# EAGLE design PlusCartUnified3 (EAGLE 9.5.2)
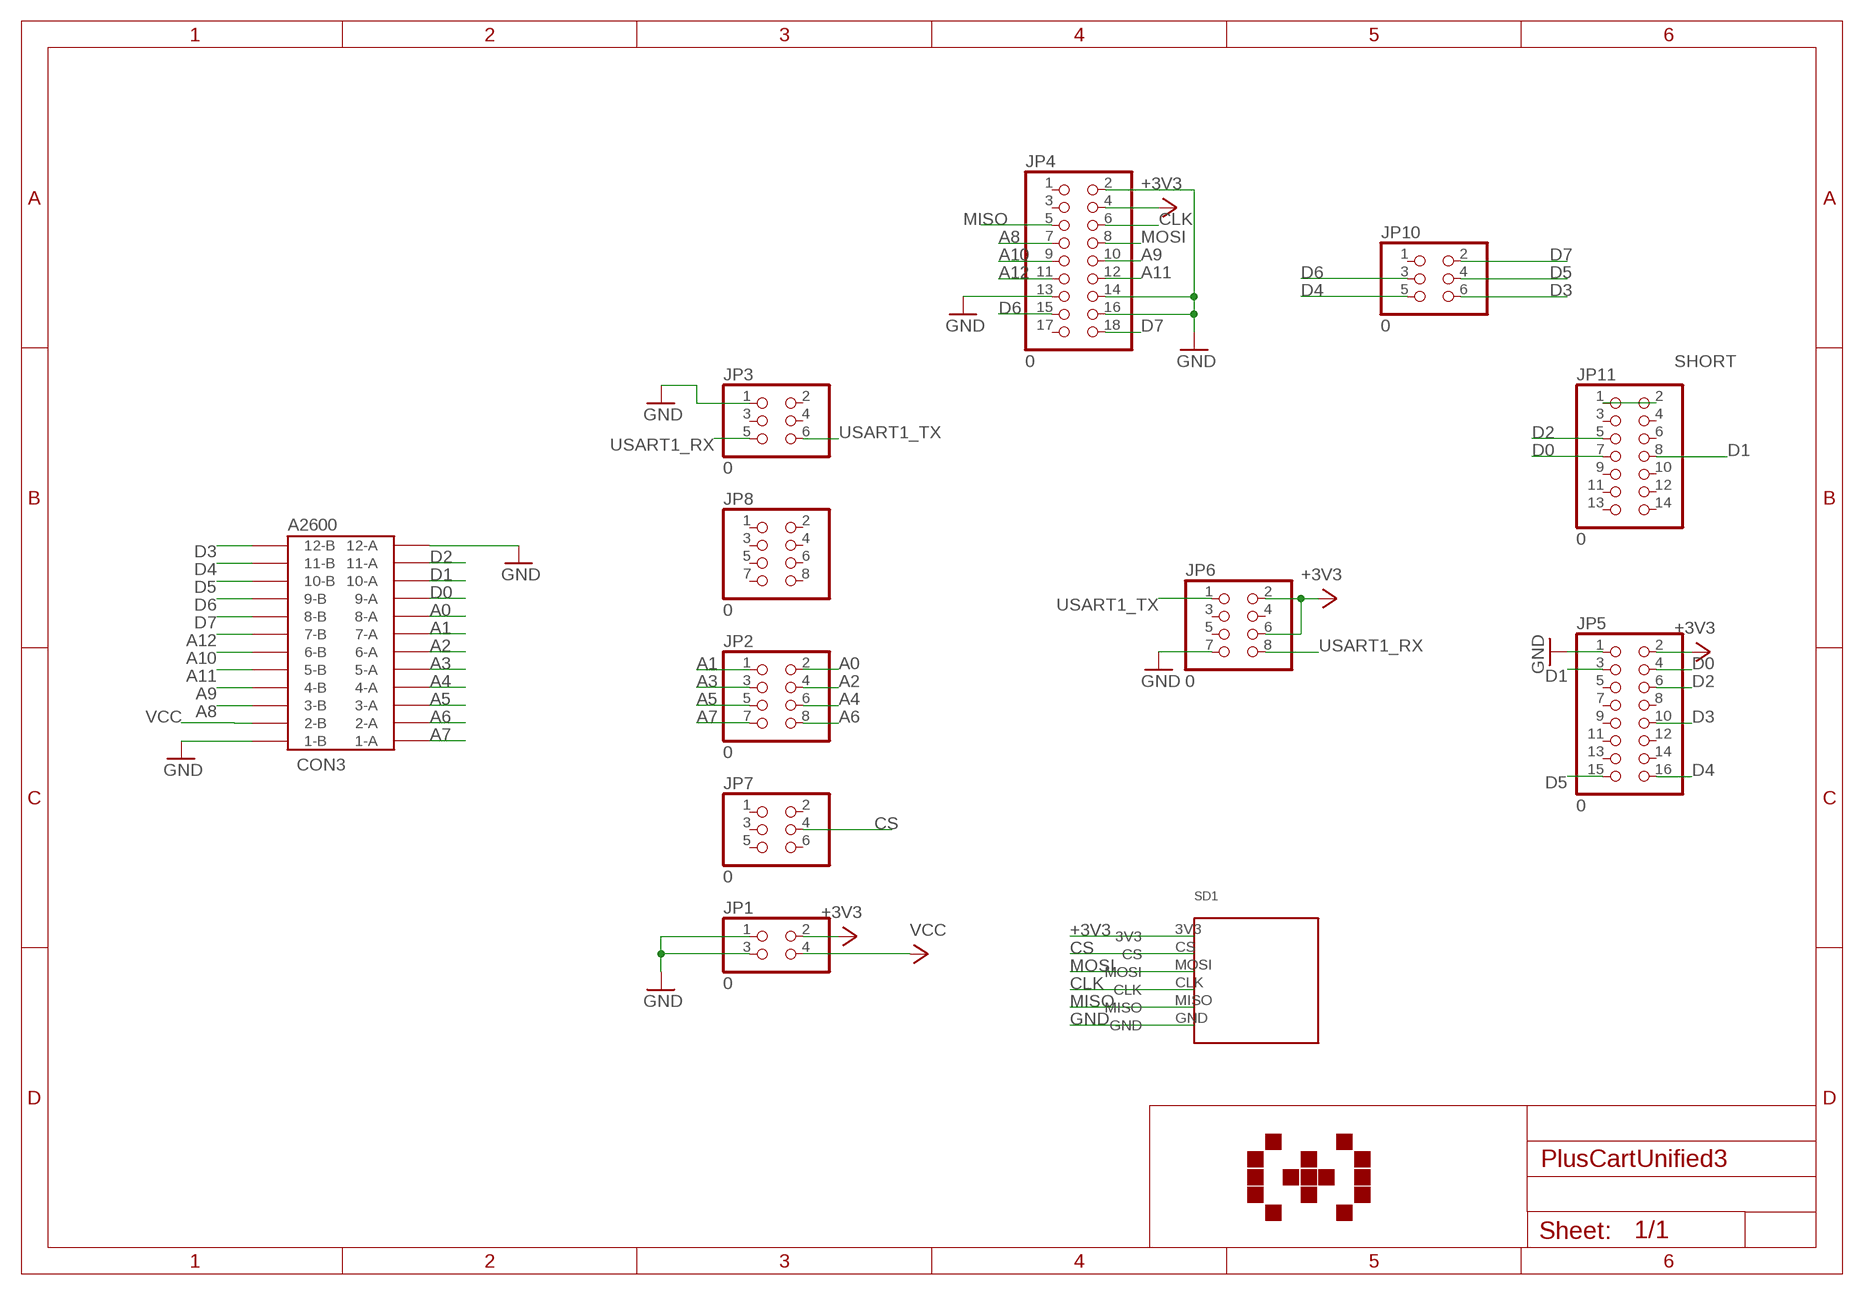
[diagram p0: schematic, sheet 1]

## Parts
CON3  A2600  24PINEDGE-254MM  [24PINEDGE-254MM]
JP1  0  PINHD-2X2  [2X02]
JP2  0  PINHD-2X4  [2X04]
JP3  0  PINHD-2X3  [2X03]
JP4  0  PINHD-2X9  [2X09]
JP5  0  PINHD-2X8  [2X08]
JP6  0  PINHD-2X4  [2X04]
JP7  0  PINHD-2X3  [2X03]
JP8  0  PINHD-2X4  [2X04]
JP10  0  PINHD-2X3  [2X03]
JP11  0  PINHD-2X7  [2X07]
SD1  MICROSDMICROSD2  [MICROSD_FOOTPRINT]

## Nets
+3V3: JP1.2 JP4.4 JP5.2 JP6.2 JP6.6 SD1.3V3
A0: CON3.8-A JP2.2
A1: CON3.7-A JP2.1
A2: CON3.6-A JP2.4
A3: CON3.5-A JP2.3
A4: CON3.4-A JP2.6
A5: CON3.3-A JP2.5
A6: CON3.2-A JP2.8
A7: CON3.1-A JP2.7
A8: CON3.3-B JP4.7
A9: CON3.4-B JP4.10
A10: CON3.6-B JP4.9
A11: CON3.5-B JP4.12
A12: CON3.7-B JP4.11
CLK: JP4.6 SD1.CLK
CS: JP7.4 SD1.CS
D0: CON3.9-A JP5.4 JP11.7
D1: CON3.10-A JP5.3 JP11.8
D2: CON3.11-A JP5.6 JP11.5
D3: CON3.12-B JP5.10 JP10.6
D4: CON3.11-B JP5.16 JP10.5
D5: CON3.10-B JP5.15 JP10.4
D6: CON3.9-B JP4.15 JP10.3
D7: CON3.8-B JP4.18 JP10.2
GND: CON3.1-B CON3.12-A JP1.1 JP1.3 JP3.1 JP4.2 JP4.13 JP4.14 JP4.16 JP5.1 JP6.7 SD1.GND
MISO: JP4.5 SD1.MISO
MOSI: JP4.8 SD1.MOSI
SHORT: JP11.1 JP11.2
USART1_RX: JP3.5 JP6.8
USART1_TX: JP3.6 JP6.1
VCC: CON3.2-B JP1.4
Unconnected: JP3.2 JP3.3 JP3.4 JP4.1 JP4.3 JP4.17 JP5.5 JP5.7 JP5.8 JP5.9 JP5.11 JP5.12 JP5.13 JP5.14 JP6.3 JP6.4 JP6.5 JP7.1 JP7.2 JP7.3 JP7.5 JP7.6 JP8.1 JP8.2 JP8.3 JP8.4 JP8.5 JP8.6 JP8.7 JP8.8 JP10.1 JP11.3 JP11.4 JP11.6 JP11.9 JP11.10 JP11.11 JP11.12 JP11.13 JP11.14

## Library data of the parts
CON3 = con-edge:24PINEDGE-254MM: 24 PIN EDGE CONNECTOR 2.54mm ATARI 2600 CARTRIDGE PORT
JP1 = pinhead:PINHD-2X2: PIN HEADER
JP2 JP6 = pinhead:PINHD-2X4: PIN HEADER
JP3 = pinhead:PINHD-2X3: PIN HEADER
JP4 = pinhead:PINHD-2X9: PIN HEADER
JP5 = pinhead:PINHD-2X8: PIN HEADER
JP7 JP10 = pinhead@1:PINHD-2X3: PIN HEADER
JP8 = pinhead@1:PINHD-2X4: PIN HEADER
JP11 = pinhead@1:PINHD-2X7: PIN HEADER
SD1 = MICROSD:MICROSD

## Board
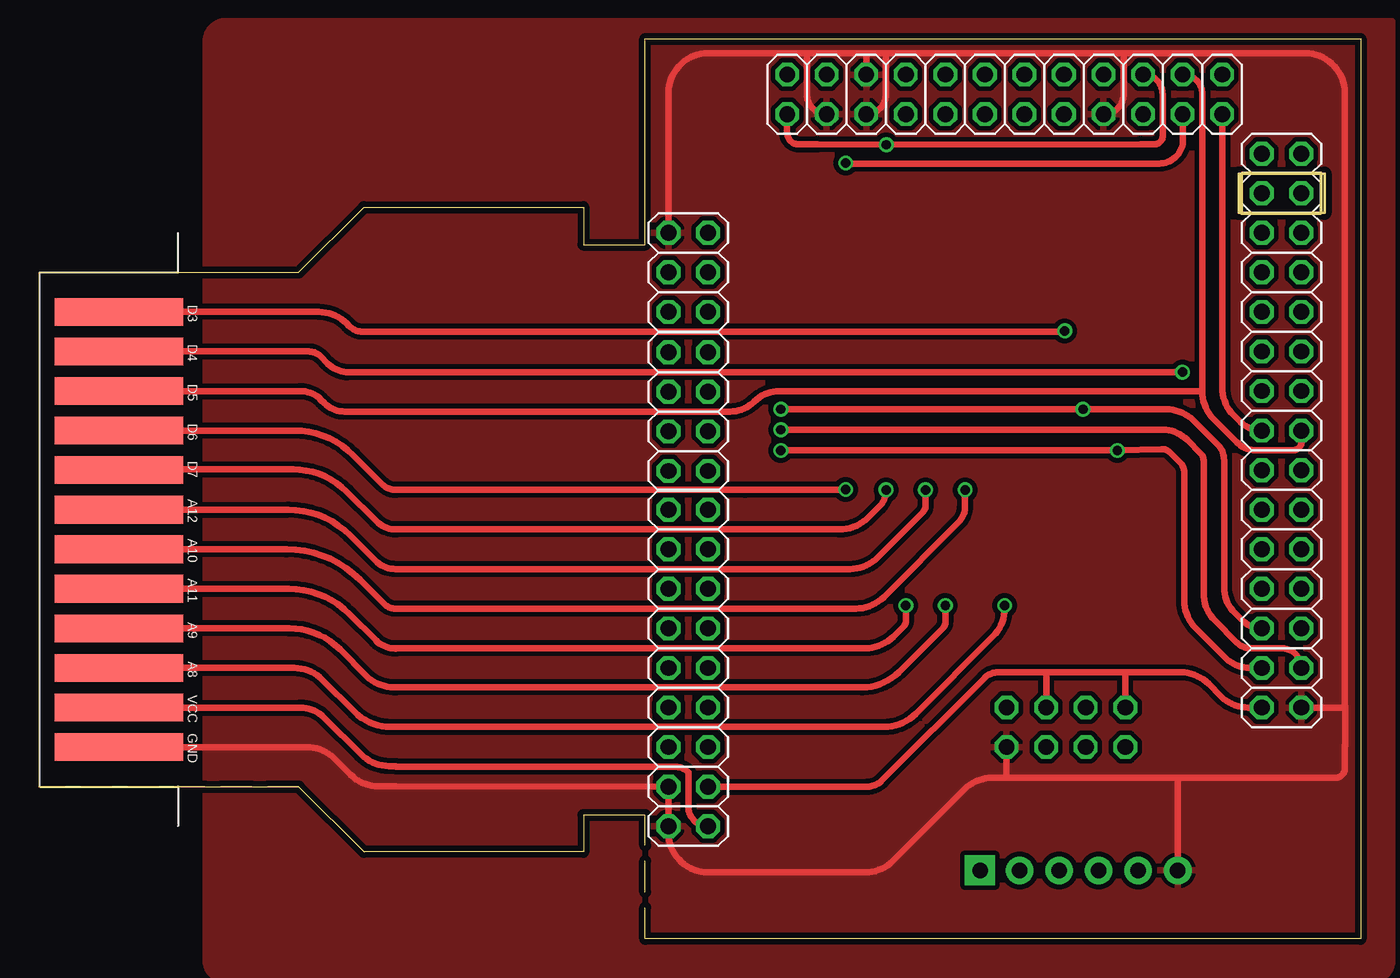
[diagram p1: board, top side]
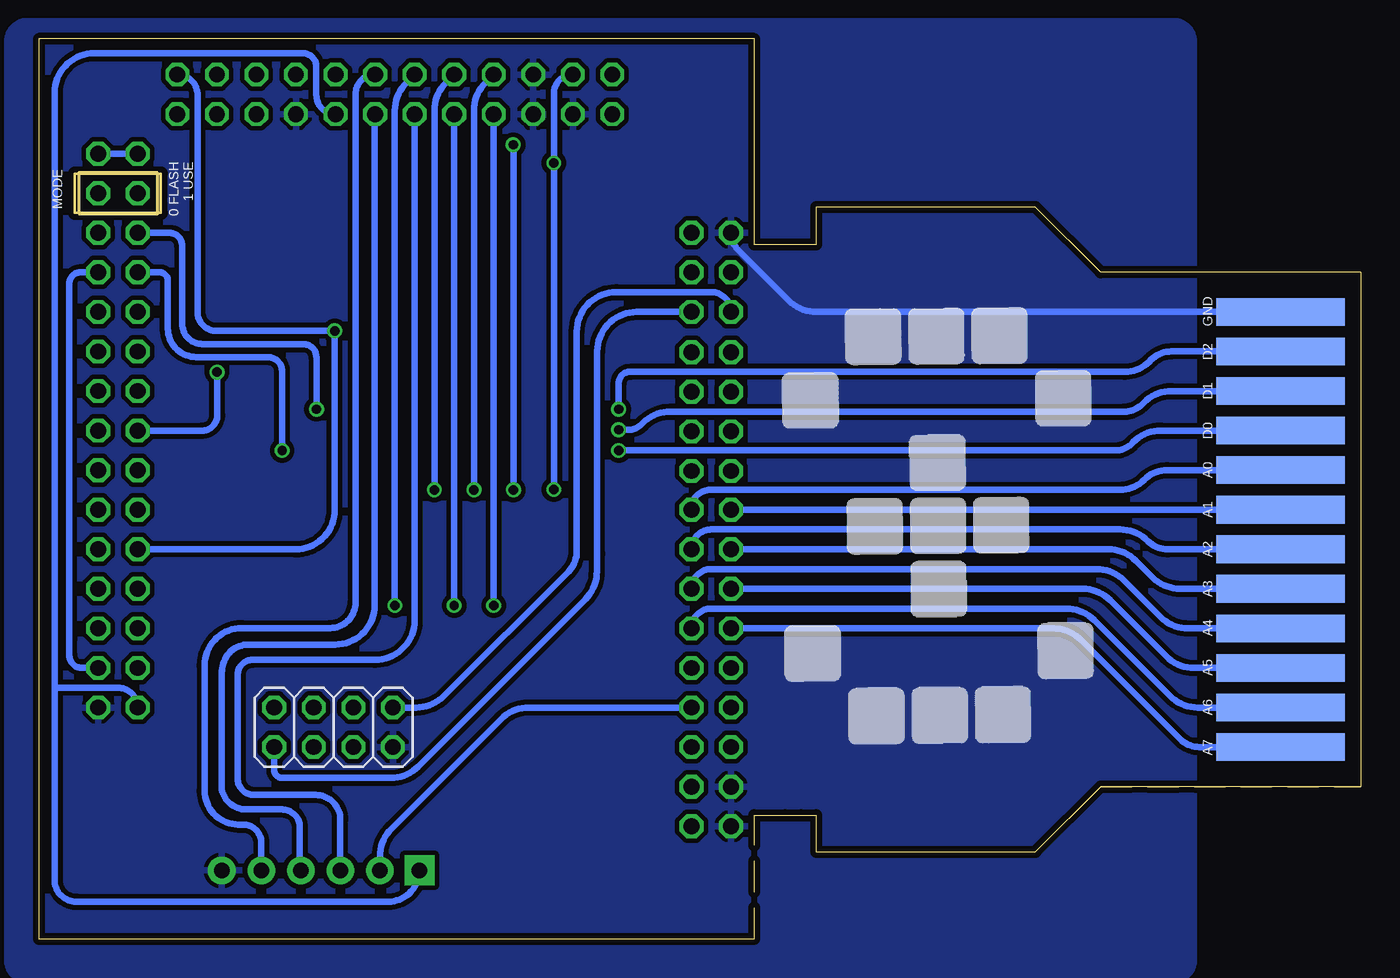
[diagram p2: board, bottom side, seen from below]

Size 84.89 x 57.78 mm. Coordinates in mm from the lower left corner, seen from the top.
Outline: 38.94,7.94 34.98,7.94
Outline: 34.98,7.94 34.98,5.58 20.88,5.58 16.69,9.77
Outline: 0,9.77 0,42.79 16.69,42.79 20.88,46.98 34.98,46.98 34.98,44.57 38.94,44.57 38.94,57.78 84.89,57.78 84.89,0 38.94,0 38.94,7.94
Outline: 0,9.77 16.69,9.77
Outline: 38.94,7.94 34.98,7.94
Outline: 16.69,9.77 0,9.77
Copper layers (1*16): Top 0.0356mm / dielectric 1.5011mm / Bottom 0.0356mm
Design rules "OSHPark2layer": minimum track width 6mil, minimum drill 13mil, track to track 6mil, track to pad 6mil, pad to pad 6mil, via to via 6mil, smd to smd 6mil, copper to edge 15mil, drill to drill 6mil, minimum pad ring 7mil, minimum via ring 7mil, stop-mask expansion 3mil, vias tented up to drill 0mil, thermal gap 10mil
Milling: 4 lines

### Footprints (pad centres in the part's own frame; a part is rotated, then mirrored left to right if it is on the bottom)
24PINEDGE-254MM = smd 1.778 x 8.255: 1-A -22.86,-7.62; 2-A -20.32,-7.62; 3-A -17.78,-7.62; 4-A -15.24,-7.62; 5-A -12.7,-7.62; 6-A -10.16,-7.62; 7-A -7.62,-7.62; 8-A -5.08,-7.62; 9-A -2.54,-7.62; 10-A 0,-7.62; 11-A 2.54,-7.62; 12-A 5.08,-7.62 | smd 1.778 x 8.255 bottom: 1-B -22.86,-7.62; 2-B -20.32,-7.62; 3-B -17.78,-7.62; 4-B -15.24,-7.62; 5-B -12.7,-7.62; 6-B -10.16,-7.62; 7-B -7.62,-7.62; 8-B -5.08,-7.62; 9-B -2.54,-7.62; 10-B 0,-7.62; 11-B 2.54,-7.62; 12-B 5.08,-7.62
2X02 = drill 1.016 octagon: 1 -1.27,-1.27; 2 -1.27,1.27; 3 1.27,-1.27; 4 1.27,1.27
2X04 = drill 1.016 octagon: 1 -3.81,-1.27; 2 -3.81,1.27; 3 -1.27,-1.27; 4 -1.27,1.27; 5 1.27,-1.27; 6 1.27,1.27; 7 3.81,-1.27; 8 3.81,1.27
2X03 = drill 1.016 octagon: 1 -2.54,-1.27; 2 -2.54,1.27; 3 0,-1.27; 4 0,1.27; 5 2.54,-1.27; 6 2.54,1.27
2X09 = drill 1.016 octagon: 1 -10.16,-1.27; 2 -10.16,1.27; 3 -7.62,-1.27; 4 -7.62,1.27; 5 -5.08,-1.27; 6 -5.08,1.27; 7 -2.54,-1.27; 8 -2.54,1.27; 9 0,-1.27; 10 0,1.27; 11 2.54,-1.27; 12 2.54,1.27; 13 5.08,-1.27; 14 5.08,1.27; 15 7.62,-1.27; 16 7.62,1.27; 17 10.16,-1.27; 18 10.16,1.27
2X08 = drill 1.016 octagon: 1 -8.89,-1.27; 2 -8.89,1.27; 3 -6.35,-1.27; 4 -6.35,1.27; 5 -3.81,-1.27; 6 -3.81,1.27; 7 -1.27,-1.27; 8 -1.27,1.27; 9 1.27,-1.27; 10 1.27,1.27; 11 3.81,-1.27; 12 3.81,1.27; 13 6.35,-1.27; 14 6.35,1.27; 15 8.89,-1.27; 16 8.89,1.27
2X07 = drill 1.016 octagon: 1 -7.62,-1.27; 2 -7.62,1.27; 3 -5.08,-1.27; 4 -5.08,1.27; 5 -2.54,-1.27; 6 -2.54,1.27; 7 0,-1.27; 8 0,1.27; 9 2.54,-1.27; 10 2.54,1.27; 11 5.08,-1.27; 12 5.08,1.27; 13 7.62,-1.27; 14 7.62,1.27
MICROSD_FOOTPRINT = drill 1 pad 1.93 square: 3V3 -15.24,6.35 | drill 1 pad 1.778: CLK -15.24,-1.27; CS -15.24,3.81; GND -15.24,-6.35; MISO -15.24,-3.81; MOSI -15.24,1.27

### Placement (x,y rotation side)
CON3  12.75,35.17 90 bottom
JP1  41.71,8.5 270 top
JP2  41.71,23.74 270 top
JP3  41.71,42.79 270 top
JP4  58.22,54.22 180 top
JP5  79.81,23.74 90 top
JP6  65.96,13.58 0 bottom
JP7  41.71,14.85 270 top
JP8  41.71,33.85 270 top
JP10  73.46,54.22 0 top
JP11  79.81,42.79 270 top
SD1  66.8,-10.85 270 bottom

### Tracks (layer width: path | path; a pad name or v marks a point on that pad's centre or on a via)
+3V3
  Top 0.406: JP1.2 53.22,9.77 arc45 54.12,10.14 60.71,16.74 arc-45 61.61,17.11 64.78,17.11 | JP5.2 77.67,14.85 arc-45 75.92,15.57 75.13,16.37 arc45 73.33,17.11 69.84,17.11 | 64.78,17.11 69.84,17.11 | JP6.6 64.69,16.89 arc-45 64.78,17.11 | JP6.2 69.77,16.94 arc-45 69.84,17.11
  Bottom 0.406: JP4.4 arc90 67.07,54.18 67.07,56 arc-90 67.94,56.86 81.33,56.86 arc-90 83.87,54.33 83.87,16.16 | JP5.2 arc-90 79.81,16.12 83.83,16.12 arc90 83.87,16.16 | 83.87,16.16 83.87,6.89 arc90 83.88,6.88 83.88,3.78 arc-90 82.49,2.39 62.45,2.39 arc-90 SD1.3V3
A0
  Bottom 0.406: JP2.2 42.98,27.62 arc90 41.77,28.83 15.47,28.83 arc-45 13.89,29.48 arc45 12.42,30.09 CON3.8-A
A1
  Bottom 0.406: JP2.1 CON3.7-A
A2
  Bottom 0.406: JP2.4 arc90 41.71,26.28 15.45,26.28 arc45 13.66,25.54 arc-45 12.39,25.01 CON3.6-A
A3
  Bottom 0.406: JP2.3 16.22,25.01 arc45 14.42,24.27 13.37,23.21 arc-45 11.57,22.47 CON3.5-A
A4
  Bottom 0.406: JP2.6 arc90 41.71,23.74 16.98,23.74 arc45 15.18,23 12.86,20.68 arc-45 11.06,19.93 CON3.4-A
A5
  Bottom 0.406: JP2.5 17.87,22.47 arc45 16.07,21.73 12.48,18.13 arc-45 10.68,17.39 CON3.3-A
A6
  Bottom 0.406: JP2.8 arc90 41.71,21.2 18.91,21.2 arc45 17.11,20.46 12.25,15.6 arc-45 10.45,14.85 CON3.2-A
A7
  Bottom 0.406: JP2.7 19.75,19.93 arc45 17.95,19.19 11.58,12.82 arc-45 10.36,12.31 CON3.1-A
A8  (via drill 0.6)
  Top 0.406: CON3.3-B 16.4,17.39 arc-45 18.19,16.65 20.26,14.58 arc45 22.6,13.61 54.28,13.61 arc45 56.32,14.45 61.28,19.42 arc45 62.03,21.21 v62.03,21.4
  Bottom 0.406: JP4.7 61.28,54.97 arc-45 62.03,53.17 v62.03,21.4
A9  (via drill 0.6)
  Top 0.406: v58.22,21.4 58.22,20.34 arc-45 58.05,19.95 55.23,17.12 arc-45 52.89,16.15 22.91,16.15 22.82,16.15 arc-45 21.02,16.89 19.33,18.58 arc45 16.08,19.93 CON3.4-B
  Bottom 0.406: JP4.10 v58.22,21.4
A10  (via drill 0.6)
  Top 0.406: v59.49,28.82 59.49,27.78 arc-45 59.06,26.74 54.26,21.95 arc-45 52.47,21.2 22.91,21.2 arc-45 22.17,21.51 20.62,23.06 arc45 15.91,25.01 CON3.6-B
  Bottom 0.406: JP4.9 58.74,54.97 arc-45 59.49,53.17 v59.49,28.82
A11  (via drill 0.6)
  Top 0.406: v55.68,21.4 55.68,20.39 arc-45 55.55,20.09 54.87,19.41 arc-45 53.07,18.66 22.97,18.66 arc45 22.91,18.64 arc-45 21.65,19.16 19.96,20.85 arc45 16.05,22.47 CON3.5-B
  Bottom 0.406: JP4.12 v55.68,21.4
A12  (via drill 0.6)
  Top 0.406: v56.95,28.82 56.95,27.83 arc-45 56.75,27.35 53.88,24.48 arc-45 52.08,23.74 22.91,23.74 arc-45 21.61,24.28 19.98,25.91 arc45 16.01,27.55 CON3.7-B
  Bottom 0.406: JP4.11 56.2,54.97 arc-45 56.95,53.17 v56.95,28.82
CLK
  Bottom 0.406: JP4.6 arc-45 63.32,52.9 63.32,21.43 arc90 65.86,18.89 71.42,18.89 arc-90 73.11,17.2 arc-90 73.16,17.15 73.16,9.89 arc-90 71.59,8.31 69.27,8.31 arc90 68.13,7.17 68.13,4.46 arc-90 SD1.CLK
CS
  Bottom 0.406: JP7.4 53.41,14.85 arc-45 55.21,14.11 62.24,7.07 arc-45 62.99,5.28 SD1.CS
D0  (via drill 0.6)
  Top 0.406: JP5.4 77.76,17.39 arc-45 76.23,18.03 74.3,19.95 arc-45 73.56,21.75 73.56,29.97 arc45 73.31,30.57 72.64,31.23 arc45 72.13,31.45 v69.27,31.35 v47.65,31.35
  Bottom 0.406: v47.65,31.35 15.77,31.35 arc-45 14.71,31.79 14.61,31.89 arc45 12.82,32.63 CON3.9-A | v69.27,31.35 69.27,36.43 arc-90 70.19,37.35 74.77,37.35 arc90 76.6,39.18 76.6,40.86 arc-90 76.6,40.86 76.6,42.26 arc-90 77.13,42.79 JP11.7
D1  (via drill 0.6)
  Top 0.406: JP5.3 81.08,17.4 arc90 79.83,18.65 77.87,18.65 arc-45 76.9,19.05 75.55,20.41 arc-45 74.8,22.2 74.8,30.73 arc45 74.62,31.16 73.75,32.03 arc45 72.19,32.68 v47.65,32.68
  Bottom 0.406: CON3.10-A 12.13,35.17 arc-45 13.93,34.43 14.02,34.33 arc45 15.19,33.85 44.31,33.85 arc-45 46.11,33.11 46.18,33.04 arc45 47.04,32.68 v47.65,32.68 | JP11.8 82.23,42.79 arc-90 82.93,42.09 82.93,40.91 arc-90 82.93,40.91 82.93,19.24 arc-90 82.93,19.24 82.93,18.21 arc-90 82.11,17.39 JP5.3
D2  (via drill 0.6)
  Top 0.406: v47.65,34 v67.06,34 72.38,34 arc-45 74.18,33.26 75.72,31.72 arc-45 76.12,30.73 76.12,22.58 arc45 76.81,20.92 77.28,20.45 arc45 JP5.6
  Bottom 0.406: v47.65,34 47.65,35.68 arc90 46.92,36.41 15.15,36.41 arc-45 13.57,37.06 13.46,37.17 arc45 12.16,37.71 CON3.11-A | v67.06,34 arc90 v67.07,34.01 67.07,37.33 arc-90 67.92,38.19 74.39,38.19 arc90 75.68,39.48 75.68,42.79 arc90 75.69,42.8 75.69,44.51 arc-90 76.51,45.33 JP11.5
D3  (via drill 0.6)
  Top 0.406: v65.89,39.03 65.83,38.98 20.81,38.98 arc-45 19.94,39.34 19.77,39.51 arc45 17.97,40.25 CON3.12-B
  Bottom 0.406: JP5.10 68.42,25.01 arc-90 65.88,27.55 65.88,39.01 arc-45 v65.89,39.03 73.48,39.03 arc90 74.7,40.25 74.7,44.37 arc-90 74.7,44.38 74.7,54.16 arc-90 JP10.6
D4  (via drill 0.6)
  Top 0.406: JP5.16 arc-45 77.15,33.21 76.74,33.61 arc-45 76,35.41 76,36.43 arc45 76.02,36.48 JP10.5 | CON3.11-B 17.34,37.71 arc-45 18.09,37.4 18.55,36.94 arc45 19.89,36.38 v73.45,36.38
  Bottom 0.406: JP5.16 74.41,32.63 arc-90 73.44,33.6 v73.44,36.37 arc-90 v73.45,36.38
D5
  Top 0.406: JP10.4 arc-90 74.73,54.24 74.73,35.19 arc-90 74.71,35.17 | 74.71,35.17 74.71,35.16 arc45 75.46,33.36 76.95,31.88 arc45 78.16,31.38 80.55,31.38 arc90 81.1,31.93 81.1,32.61 arc90 JP5.15 | 74.71,35.17 73.07,35.17 47.58,35.17 arc45 45.92,34.48 arc-45 44.39,33.85 19.63,33.85 arc-45 18.34,34.38 18.11,34.61 arc45 16.76,35.17 CON3.10-B
D6  (via drill 0.6)
  Top 0.406: v51.82,28.85 45.39,28.85 45.36,28.82 22.91,28.82 arc-45 22.09,29.16 20.19,31.06 arc45 16.4,32.63 CON3.9-B | JP10.3 73.48,51.31 arc-90 71.95,49.78 51.86,49.78 arc-90 v51.82,49.81
  Bottom 0.406: v51.82,28.85 v51.82,49.81 51.82,54.27 arc90 JP4.15
D7  (via drill 0.6)
  Top 0.406: v54.41,28.82 arc-45 53.96,27.74 53.29,27.07 arc-45 51.39,26.28 22.97,26.28 arc-45 21.65,26.83 19.77,28.71 arc45 16.31,30.14 5.25,30.14 arc45 CON3.8-B | JP4.18 48.06,51.76 arc90 48.8,51.01 49.98,51.01 arc90 49.99,51.02 v54.42,50.98 70.76,51.02 71.66,51.02 arc90 72.17,51.53 72.17,54.23 arc90 JP10.2
  Bottom 0.406: v54.41,28.82 54.41,50.95 arc-90 v54.42,50.98
GND
  Top 0.406: 83.87,14.95 83.87,54.31 arc90 81.33,56.86 69.68,56.86 | 69.68,56.86 54.41,56.86 | 54.41,56.86 53.19,56.86 | JP4.2 arc90 69.68,54.25 69.68,56.86 | JP3.1 40.44,54.31 arc-90 42.98,56.86 49.33,56.86 | 49.33,56.86 53.19,56.86 | JP4.13 53.14,56.8 arc-90 53.19,56.86 | JP4.16 arc-90 49.33,54.22 49.33,56.86 | JP4.14 arc90 54.41,54.22 54.41,56.86 | CON3.1-B 17.18,12.31 arc-45 18.98,11.57 20.01,10.54 arc45 21.8,9.8 22.91,9.8 JP1.1 JP1.3 40.44,6.81 arc90 42.98,4.27 53.06,4.27 arc45 54.85,5.01 59.44,9.6 arc-45 61.24,10.34 62.15,10.34 | JP6.7 62.15,10.34 | 83.87,14.95 arc-90 83.89,14.92 83.89,12.43 arc90 83.89,12.43 83.89,10.96 arc-90 83.27,10.34 73.13,10.34 | JP5.1 83.77,14.85 arc90 83.87,14.95 | 62.15,10.34 73.13,10.34 | 73.15,10.32 arc90 73.13,10.34 | SD1.GND 73.15,10.32 | 73.15,10.32 arc90 73.13,10.34
  Bottom 0.406: JP3.1 arc-45 39.99,44.25 36.74,41 arc-45 34.94,40.25 CON3.12-A
  pour Top (isolate 0.305): 10.72,-1.41 10.72,57.65 arc-90 11.99,58.92 86.92,58.92 86.92,-1.41 arc-90 85.65,-2.67 11.99,-2.67 arc-90
  pour Bottom (isolate 0.305): 10.72,57.65 10.72,-1.41 arc90 11.99,-2.67 85.65,-2.67 arc90 86.92,-1.41 86.92,57.65 arc90 85.65,58.92 11.99,58.92 arc90
MISO
  Bottom 0.406: JP4.5 arc-90 64.55,54.24 64.55,21.59 arc90 66.19,19.95 71.84,19.95 arc-90 74.24,17.55 74.24,9.5 arc-90 72.08,7.34 71.78,7.34 arc90 70.61,6.16 SD1.MISO
MOSI
  Bottom 0.406: JP4.8 60.76,20.45 arc90 63.3,17.91 71.17,17.91 arc-90 72.12,16.96 72.12,10.29 arc-90 71.07,9.24 67.11,9.24 arc90 65.53,7.65 SD1.MOSI
SHORT
  Bottom 0.406: JP11.1 JP11.2
USART1_RX
  Bottom 0.406: JP3.5 arc-90 41.71,41.52 47.8,41.52 arc-90 50.34,38.98 50.34,24.88 arc45 50.88,23.58 58.87,15.6 arc45 60.67,14.85 JP6.8
USART1_TX
  Bottom 0.406: JP3.6 46.49,40.25 arc-90 49.03,37.71 49.03,24.73 arc45 49.05,24.69 49.05,23.59 arc45 49.79,21.79 60.53,11.06 arc45 62.29,10.33 69.26,10.33 arc90 69.77,10.84 JP6.1
VCC
  Top 0.406: JP1.4 arc-90 41.71,8.5 arc45 41.71,8.5 41.71,10.7 arc45 40.87,11.05 22.95,11.05 22.91,11.09 22.49,11.09 arc-45 20.69,11.84 18.32,14.2 arc45 16.76,14.85 CON3.2-B

### Text on the board
tNames: D3 | D4 | D5 | D6 | D7 | A12 | A10 | A11 | A9 | A8 | VCC | GND
bNames: 0 FLASH / 1 USE | MODE | GND | D2 | D1 | D0 | A0 | A1 | A2 | A3 | A4 | A5 | A6 | A7